# EAGLE design Proximity_CIM_PCB (EAGLE 6.4)
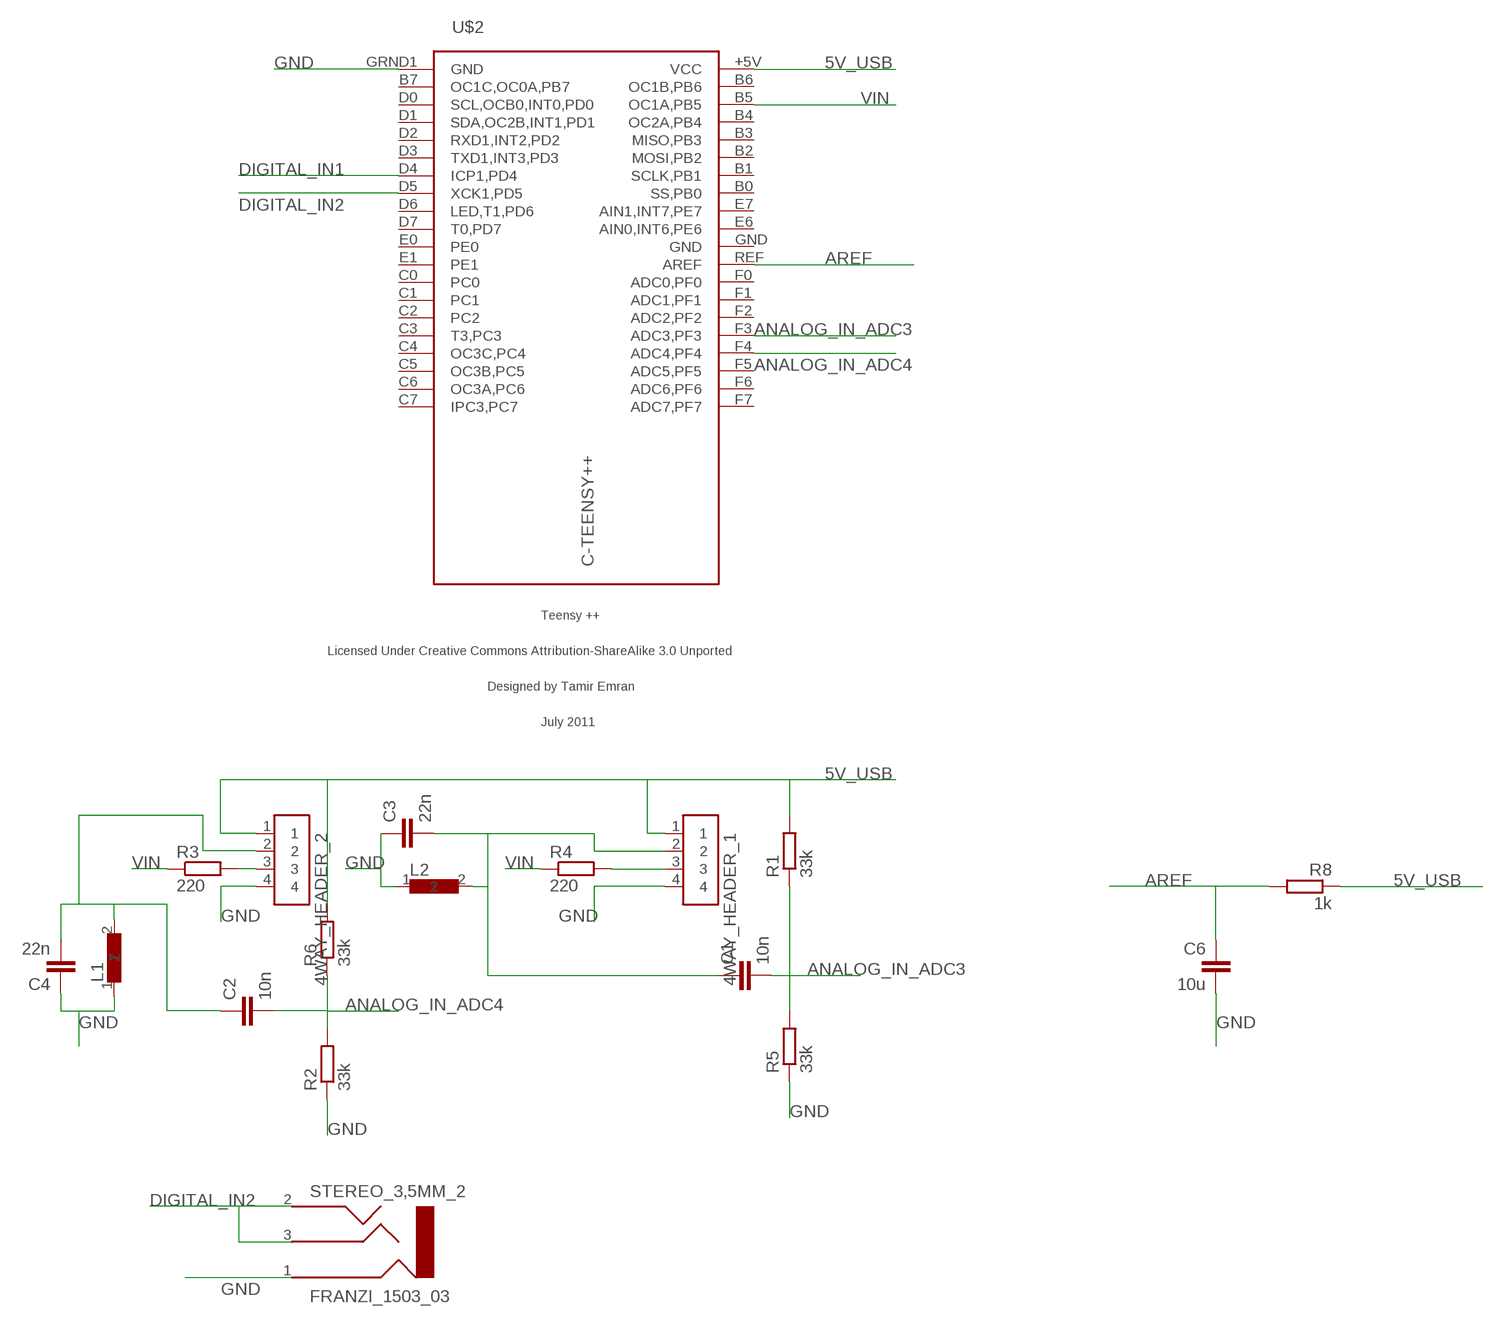
[diagram p0: schematic, sheet 1]

## Parts
4WAY_HEADER_1  4WAY_HEADER  [4WAY_HEADER]
4WAY_HEADER_2  4WAY_HEADER  [4WAY_HEADER]
C1  10n  C-EUC0805  [C0805]
C2  10n  C-EUC0805  [C0805]
C3  22n  C-EUC1206  [C1206]
C4  22n  C-EUC1206  [C1206]
C6  10u  C-EUC0805  [C0805]
L1  INDUCTOR_1  [INDUCTOR_1]
L2  INDUCTOR_1  [INDUCTOR_1]
R1  33k  R-EU_R0805  [R0805]
R2  33k  R-EU_R0805  [R0805]
R3  220  R-EU_R0805  [R0805]
R4  220  R-EU_R0805  [R0805]
R5  33k  R-EU_R0805  [R0805]
R6  33k  R-EU_R0805  [R0805]
R8  1k  R-EU_R0805  [R0805]
STEREO_3,5MM_2  FRANZI_1503_03  [1503_03]
U$2  C-TEENSY++  [TEENSY++]

## Nets
5V_USB: 4WAY_HEADER_1.1 4WAY_HEADER_2.1 R1.2 R6.2 R8.1 U$2.+5V(VCC)
ANALOG_IN_ADC3: C1.2 R1.1 R5.2 U$2.F3(ADC3,PF3)
ANALOG_IN_ADC4: C2.2 R2.2 R6.1 U$2.F4(ADC4,PF4)
AREF: C6.1 R8.2 U$2.REF(AREF)
DIGITAL_IN1: U$2.D4(ICP1,PD4)
DIGITAL_IN2: STEREO_3,5MM_2.2 STEREO_3,5MM_2.3 U$2.D5(XCK1,PD5)
GND: 4WAY_HEADER_1.4 4WAY_HEADER_2.4 C3.1 C4.1 C6.2 L1.1 L2.1 R2.1 R5.1 STEREO_3,5MM_2.1 U$2.GRND1(GND)
N$2: 4WAY_HEADER_1.3 R4.2
N$3: 4WAY_HEADER_1.2 C1.1 C3.2 L2.2
N$4: 4WAY_HEADER_2.2 C2.1 C4.2 L1.2
N$5: 4WAY_HEADER_2.3 R3.2
VIN: R3.1 R4.1 U$2.B5(OC1A,PB5)
Unconnected: U$2.B0(SS,PB0) U$2.B1(SCLK,PB1) U$2.B2(MOSI,PB2) U$2.B3(MISO,PB3) U$2.B4(OC2A,PB4) U$2.B6(OC1B,PB6) U$2.B7(OC1C,OC0A,PB7) U$2.C0 U$2.C1 U$2.C2 U$2.C3(T3,PC3) U$2.C4(OC3C,PC4) U$2.C5(OC3B,PC5) U$2.C6(OC3A,PC6) U$2.C7(IPC3,PC7) U$2.D0(SCL,OCB0,INT0,PD0) U$2.D1(SDA,OC2B,INT1,PD1) U$2.D2(RXD1,INT2,PD2) U$2.D3(TXD1,INT3,PD3) U$2.D6(LED,T1,PD6) U$2.D7(T0,PD7) U$2.E0 U$2.E1 U$2.E6(AIN0,INT6,PE6) U$2.E7(AIN1,INT7,PE7) U$2.F0(ADC0,PF0) U$2.F1(ADC1,PF1) U$2.F2(ADC2,PF2) U$2.F5(ADC5,PF5) U$2.F6(ADC6,PF6) U$2.F7(ADC7,PF7)

## Power pins joined to a net without a drawn wire
GND: U$2.GND

## Library data of the parts
4WAY_HEADER_1 4WAY_HEADER_2 = Franzi_4Way_Header:4WAY_HEADER
C1-C4 C6 = rcl:C-EU: CAPACITOR, European symbol
L1 L2 = Franzi_Inductor:INDUCTOR_1
R1-R6 R8 = resistor:R-EU_: RESISTOR, European symbol
STEREO_3,5MM_2 = Franzi_1503_03:FRANZI_1503_03
U$2 = Franzi_teensypp:C-TEENSY++

## Board
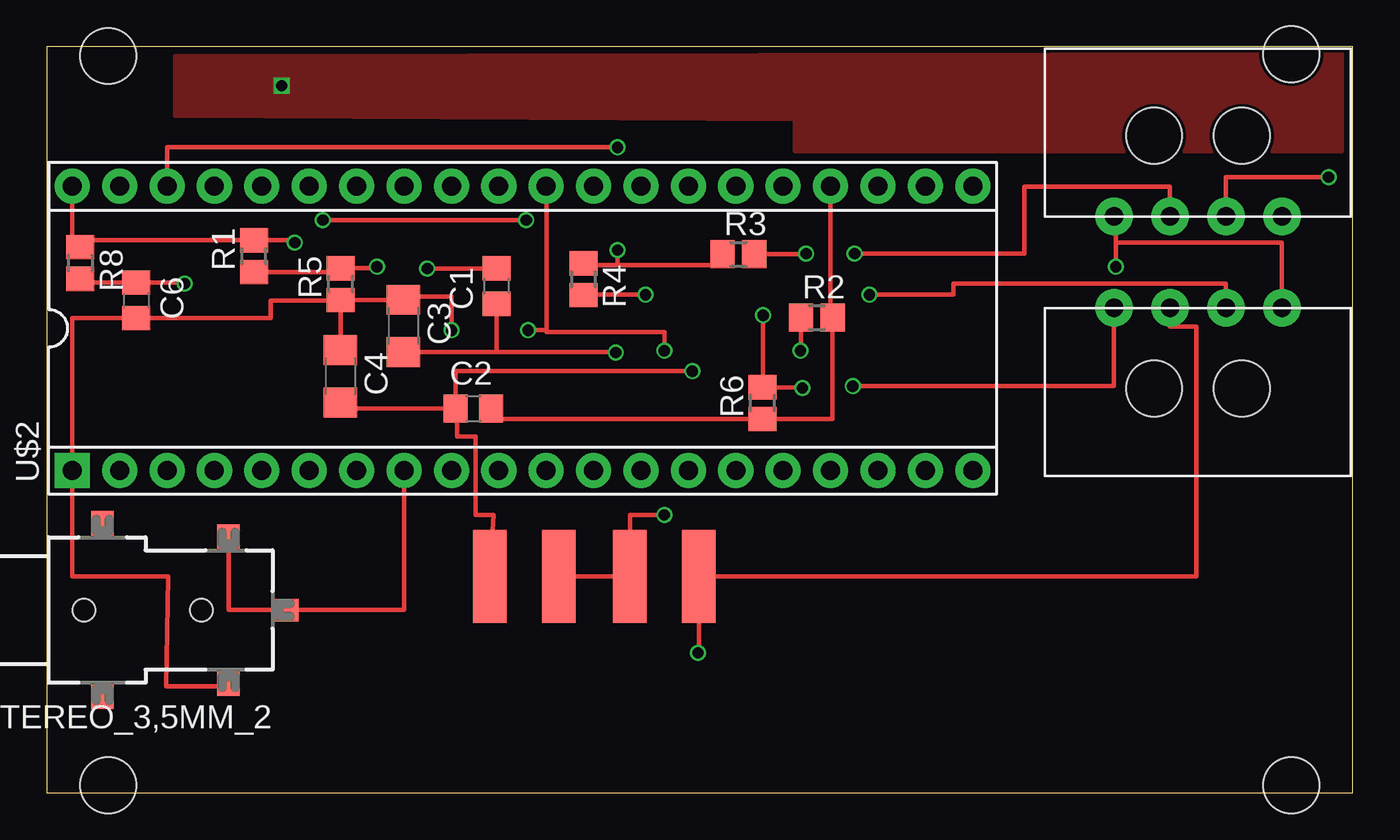
[diagram p1: board, top side]
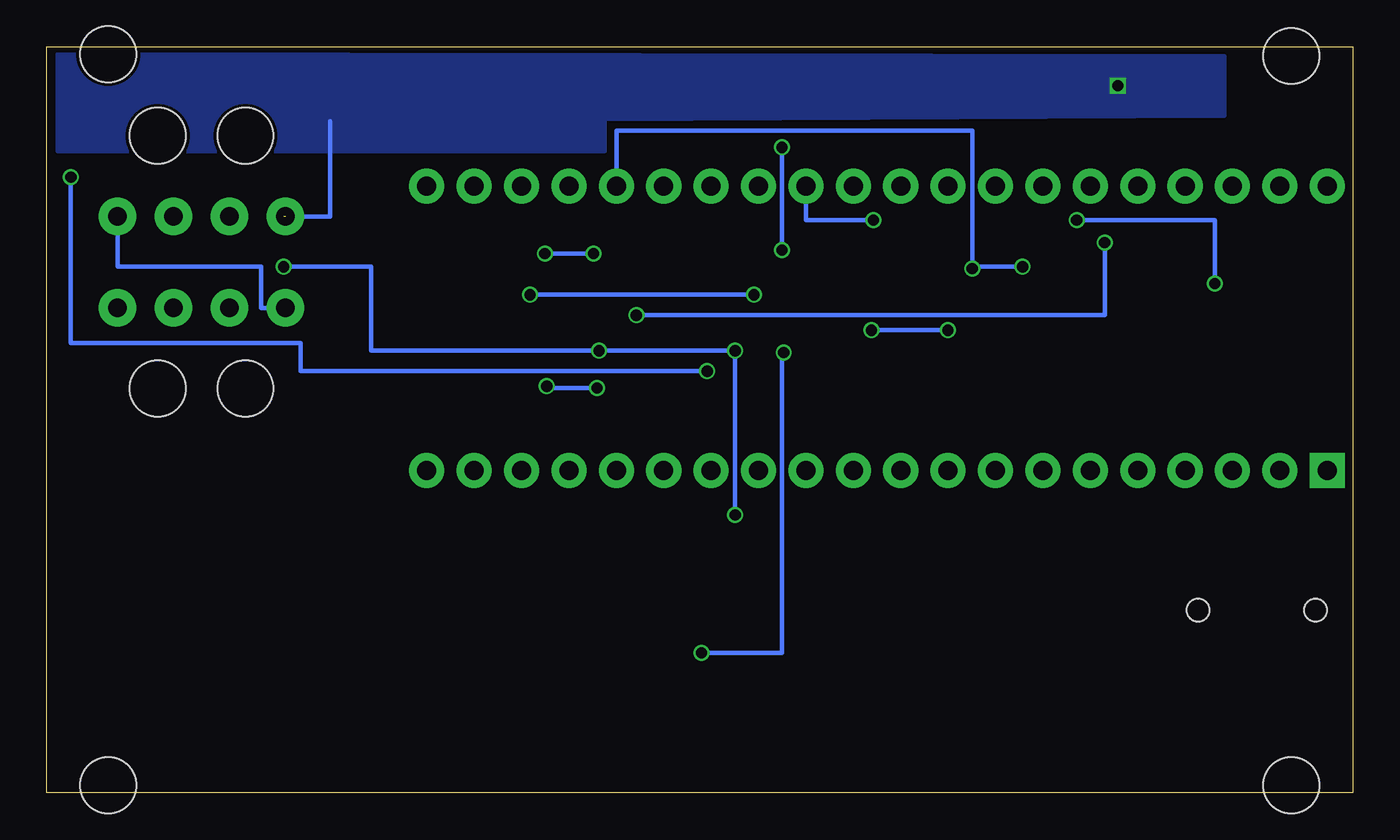
[diagram p2: board, bottom side, seen from below]

Size 70 x 40 mm. Coordinates in mm from the lower left corner, seen from the top.
Outline: 0,0 70,0 70,40 0,40 0,0
Copper layers (1+16): Top 0.035mm / dielectric 0.5mm / Bottom 0.035mm
Design rules: minimum track width 6mil, minimum drill 8mil, track to track 6mil, track to pad 6mil, pad to pad 6mil, via to via 6mil, smd to smd 6mil, copper to edge 8mil, drill to drill 15mil, minimum pad ring 7mil, minimum via ring 5mil, stop-mask expansion 2mil, vias tented up to drill 20mil, thermal gap 5mil
Holes 3 mm at 3.3,39.5 66.7,39.6 66.7,0.4 3.3,0.4

### Footprints (pad centres in the part's own frame; a part is rotated, then mirrored left to right if it is on the bottom)
4WAY_HEADER = drill 1 pad 2: 1 -3,0; 2 0,0; 3 3,0; 4 6,0 | hole 3: -0.85,-4.32; 3.85,-4.32
C0805 = smd 1.3 x 1.5: 1 -0.95,0; 2 0.95,0
C1206 = smd 1.6 x 1.8: 1 -1.4,0; 2 1.4,0
INDUCTOR_1 = smd 1.8 x 5: 1 -1.85,0; 2 1.85,0
R0805 = smd 1.3 x 1.5: 1 -0.85,0; 2 0.85,0
1503_03 = smd 1.4 x 1.2: 1 -3.9,-9.75; 3 3.9,-9.75; NOT_USED1 4.6,-3; NOT_USED2 -4.6,-3 | smd 1.2 x 1.4: 2 0,-12.8 | hole 1.2: 0,-2; 0,-8.3
TEENSY++ = drill 1.016 pad 1.88: +5V -24.13,7.62; B0 -6.35,7.62; B1 -8.89,7.62; B2 -11.43,7.62; B3 -13.97,7.62; B4 -16.51,7.62; B5 -19.05,7.62; B6 -21.59,7.62; B7 -21.59,-7.62; C0 6.35,-7.62; C1 8.89,-7.62; C2 11.43,-7.62; C3 13.97,-7.62; C4 16.51,-7.62; C5 19.05,-7.62; C6 21.59,-7.62; C7 24.13,-7.62; D0 -19.05,-7.62; D1 -16.51,-7.62; D2 -13.97,-7.62; D3 -11.43,-7.62; D4 -8.89,-7.62; D5 -6.35,-7.62; D6 -3.81,-7.62; D7 -1.27,-7.62; E0 1.27,-7.62; E1 3.81,-7.62; E6 -1.27,7.62; E7 -3.81,7.62; F0 6.35,7.62; F1 8.89,7.62; F2 11.43,7.62; F3 13.97,7.62; F4 16.51,7.62; F5 19.05,7.62; F6 21.59,7.62; F7 24.13,7.62; GRND1 1.27,7.62; REF 3.81,7.62 | drill 1.016 pad 1.88 square: GND -24.13,-7.62

### Placement (x,y rotation side)
4WAY_HEADER_1  60.2,26 0 top
4WAY_HEADER_2  63.2,30.9 180 top
C1  24.12,27.17 90 top
C2  22.87,20.6 0 top
C3  19.12,25.03 270 top
C4  15.74,22.33 270 top
C6  4.8,26.4 270 top
L1  25.6,11.6 180 top
L2  33.1,11.6 0 top
R1  11.11,28.77 90 top
R2  41.27,25.48 0 top
R3  37.07,28.87 0 top
R4  28.76,27.53 270 top
R5  15.75,27.27 90 top
R6  38.36,20.89 90 top
R8  1.8,28.4 270 top
STEREO_3,5MM_2  0,9.8 90 top
U$2  25.5,24.9 0 top

### Tracks (layer width: path | path; a pad name or v marks a point on that pad's centre or on a via)
5V_USB  (via drill 0.6)
  Top 0.254: U$2.+5V 1.37,29.25 R8.1 1.8,29.62 R1.2 13.3,29.62 v13.3,29.5 | v40.5,21.7 40.5,21.74 R6.2 38.4,21.74 v38.4,25.6 | v43.2,21.8 57.2,21.8 4WAY_HEADER_1.1
  Bottom 0.254: v40.5,21.7 43.2,21.7 v43.2,21.8 | v13.3,29.5 13.3,25.6 v38.4,25.6 | 4WAY_HEADER_2.1 66.2,28.2 58.5,28.2 58.5,26 4WAY_HEADER_1.1
ANALOG_IN_ADC3  (via drill 0.6)
  Top 0.254: R1.1 15.75,27.92 R5.2 17.7,28.12 v17.7,28.2 | v20.4,28.1 24.12,28.1 C1.2
  Bottom 0.254: v17.7,28.2 20.5,28.2 v20.4,28.1 20.4,35.5 39.47,35.5 U$2.F3
ANALOG_IN_ADC4
  Top 0.254: U$2.F4 42.01,25.48 R2.2 42.12,20.04 R6.1 | 38.36,20 R6.1 | R6.1 23.82,20.04 C2.2
AREF  (via drill 0.6)
  Top 0.254: R8.2 1.8,27.35 C6.1 7.4,27.35 v7.4,27.3 | v25.7,30.7 v14.8,30.7
  Bottom 0.254: v7.4,27.3 7.4,30.7 v14.8,30.7 | U$2.REF 29.31,30.8 29.3,30.7 v25.7,30.7
DIGITAL_IN2
  Top 0.254: STEREO_3,5MM_2.3 9.75,9.8 STEREO_3,5MM_2.2 19.15,9.8 U$2.D5
GND  (via drill 0.6)  (1 unrouted)
  Top 0.254: C4.1 R5.1 | R5.1 C3.1 19.12,26.6 21.7,26.6 v21.7,24.8 | 40.42,25.35 R2.1 | 9.8,5.9 STEREO_3,5MM_2.1 9.75,5.7 6.4,5.7 6.5,11.6 1.37,11.6 U$2.GND 1.37,25.45 C6.2 12,25.45 12,26.4 15.75,26.4 R5.1 | 40.42,25.15 R2.1 | R2.1 40.42,23.7 v40.4,23.7 | 57.3,30.9 57.3,29.5 | 57.3,29.5 v57.3,28.2 | 57.3,29.5 66.2,29.5 4WAY_HEADER_1.4 | L1.1 L2.1 31.25,14.9 v33.1,14.9 | v33.1,23.7 33.1,24.7 26.8,24.7 26.8,24.8 | 26.8,24.8 26.8,32.52 U$2.GRND1 | v25.8,24.8 26.8,24.8
  Bottom 0.254: v57.3,28.2 52.6,28.2 52.6,23.7 v40.4,23.7 v33.1,23.7 v33.1,14.9 | v21.7,24.8 v25.8,24.8 | 4WAY_HEADER_2.4 54.8,30.9 54.8,36
  other vias: 12.6,37.9
  pour Bottom: 6.9,36.3 6.9,39.5 69.4,39.6 69.4,34.4 40.1,34.4 40.1,36.1
  pour Top: 6.9,36.3 6.9,39.5 69.4,39.6 69.4,34.4 40.1,34.4 40.1,36.1
N$2  (via drill 0.6)
  Top 0.254: 28.8,26.88 R4.2 28.76,26.7 v32.1,26.7 | v44.1,26.7 48.6,26.7 48.6,27.3 63.2,27.3 4WAY_HEADER_1.3
  Bottom 0.254: v32.1,26.7 v44.1,26.7
N$3  (via drill 0.6)
  Top 0.254: C3.2 24.12,23.63 | 24.12,23.63 C1.1 | v34.9,7.5 34.95,7.5 L2.2 61.6,11.6 61.6,25 60.2,25 4WAY_HEADER_1.2 | 24.12,23.63 30.5,23.63 v30.5,23.6
  Bottom 0.254: v30.5,23.6 30.6,23.5 30.6,7.5 v34.9,7.5
N$4  (via drill 0.6)
  Top 0.254: C4.2 15.74,20.6 C2.1 | C2.1 22.1,20.2 22,20.2 22,19.1 23,19.1 23,14.9 23.95,14.9 L1.2 | v68.7,33 63.2,33 4WAY_HEADER_2.2 | v34.6,22.6 21.92,22.6 C2.1
  Bottom 0.254: v68.7,33 68.7,24.1 56.4,24.1 56.4,22.6 v34.6,22.6
N$5  (via drill 0.6)
  Top 0.254: 4WAY_HEADER_2.3 60.2,32.5 52.4,32.5 52.4,28.9 50.7,28.9 50.3,28.9 v43.3,28.9 | R3.2 40.7,28.87 v40.7,28.9
  Bottom 0.254: v40.7,28.9 v43.3,28.9
VIN  (via drill 0.6)
  Top 0.254: 30.6,28.28 36.22,28.28 R3.1 | U$2.B5 6.45,34.6 v30.6,34.6 | v30.6,29.1 30.6,28.28 | 30.6,28.28 28.76,28.28 R4.1
  Bottom 0.254: v30.6,34.6 v30.6,29.1

### Text on the board
Reference: Leiterplatte 1 (Horak)